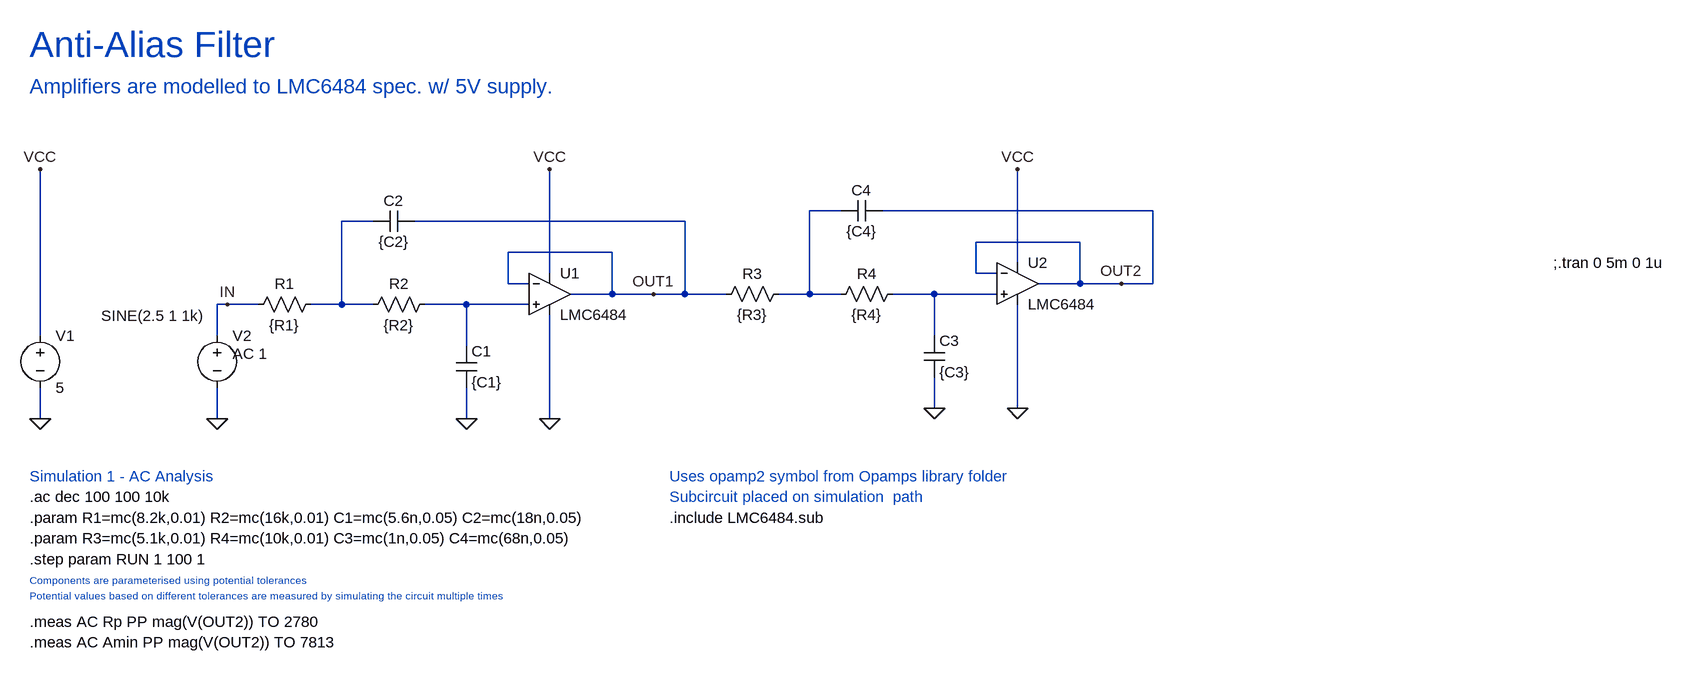
[diagram p0: schematic LMC6484_Lowpass_Toleranced(1).asc]
LMC6484_Lowpass_Toleranced(1).asc, the LTspice schematic file:
Version 4
SHEET 1 1812 800
WIRE 528 64 480 64
WIRE 1008 64 592 64
WIRE -192 80 -240 80
WIRE 288 80 -128 80
WIRE 896 112 736 112
WIRE 176 128 16 128
WIRE 800 144 800 0
WIRE 80 160 80 0
WIRE 736 160 736 112
WIRE 768 160 736 160
WIRE 16 176 16 128
WIRE 48 176 16 176
WIRE 896 176 896 112
WIRE 896 176 832 176
WIRE 960 176 896 176
WIRE 1008 176 1008 64
WIRE 1008 176 960 176
WIRE 176 192 176 128
WIRE 176 192 112 192
WIRE 240 192 176 192
WIRE 288 192 288 80
WIRE 288 192 240 192
WIRE 352 192 288 192
WIRE 480 192 480 64
WIRE 480 192 432 192
WIRE 528 192 480 192
WIRE 672 192 608 192
WIRE 768 192 672 192
WIRE -416 208 -432 208
WIRE -368 208 -416 208
WIRE -240 208 -240 80
WIRE -240 208 -288 208
WIRE -192 208 -240 208
WIRE -48 208 -112 208
WIRE 48 208 -48 208
WIRE -704 256 -704 0
WIRE -432 256 -432 208
WIRE 672 256 672 192
WIRE -48 272 -48 208
WIRE 672 368 672 320
WIRE 800 368 800 208
WIRE -704 384 -704 336
WIRE -432 384 -432 336
WIRE -48 384 -48 336
WIRE 80 384 80 224
FLAG 80 384 0
FLAG -432 384 0
FLAG -704 384 0
FLAG -48 384 0
FLAG 240 192 OUT1
FLAG 800 368 0
FLAG 672 368 0
FLAG 960 176 OUT2
FLAG -416 208 IN
FLAG 80 0 VCC
FLAG 800 0 VCC
FLAG -704 0 VCC
SYMBOL Opamps\\opamp2 80 128 R0
SYMATTR InstName U1
SYMATTR Value LMC6484
SYMBOL voltage -704 240 R0
SYMATTR InstName V1
SYMATTR Value 5
SYMBOL res -272 192 R90
WINDOW 0 0 56 VBottom 2
WINDOW 3 32 56 VTop 2
SYMATTR InstName R1
SYMATTR Value {R1}
SYMBOL voltage -432 240 R0
WINDOW 3 -178 -15 Left 2
WINDOW 123 24 44 Left 2
WINDOW 39 0 0 Left 2
SYMATTR Value SINE(2.5 1 1k)
SYMATTR Value2 AC 1
SYMATTR InstName V2
SYMBOL res -96 192 R90
WINDOW 0 0 56 VBottom 2
WINDOW 3 32 56 VTop 2
SYMATTR InstName R2
SYMATTR Value {R2}
SYMBOL cap -64 272 R0
SYMATTR InstName C1
SYMATTR Value {C1}
SYMBOL cap -128 64 R90
WINDOW 0 0 32 VBottom 2
WINDOW 3 32 32 VTop 2
SYMATTR InstName C2
SYMATTR Value {C2}
SYMBOL Opamps\\opamp2 800 112 R0
SYMATTR InstName U2
SYMATTR Value LMC6484
SYMBOL res 448 176 R90
WINDOW 0 0 56 VBottom 2
WINDOW 3 32 56 VTop 2
SYMATTR InstName R3
SYMATTR Value {R3}
SYMBOL res 624 176 R90
WINDOW 0 0 56 VBottom 2
WINDOW 3 32 56 VTop 2
SYMATTR InstName R4
SYMATTR Value {R4}
SYMBOL cap 656 256 R0
SYMATTR InstName C3
SYMATTR Value {C3}
SYMBOL cap 592 48 R90
WINDOW 0 0 32 VBottom 2
WINDOW 3 32 32 VTop 2
SYMATTR InstName C4
SYMATTR Value {C4}
TEXT 264 536 Left 2 !.include LMC6484.sub
TEXT 1624 144 Left 2 !;.tran 0 5m 0 1u
TEXT -720 504 Left 2 !.ac dec 100 100 10k
TEXT -720 600 Left 2 !.step param RUN 1 100 1
TEXT -720 696 Left 2 !.meas AC Rp PP mag(V(OUT2)) TO 2780
TEXT -720 728 Left 2 !.meas AC Amin PP mag(V(OUT2)) TO 7813
TEXT -720 568 Left 2 !.param R3=mc(5.1k,0.01) R4=mc(10k,0.01) C3=mc(1n,0.05) C4=mc(68n,0.05)
TEXT -720 536 Left 2 !.param R1=mc(8.2k,0.01) R2=mc(16k,0.01) C1=mc(5.6n,0.05) C2=mc(18n,0.05)
TEXT -720 -192 Left 5 ;Anti-Alias Filter
TEXT -720 -128 Left 3 ;Amplifiers are modelled to LMC6484 spec. w/ 5V supply.
TEXT 264 472 Left 2 ;Uses opamp2 symbol from Opamps library folder
TEXT 264 504 Left 2 ;Subcircuit placed on simulation  path
TEXT -720 472 Left 2 ;Simulation 1 - AC Analysis
TEXT -720 632 Left 1 ;Components are parameterised using potential tolerances
TEXT -720 656 Left 1 ;Potential values based on different tolerances are measured by simulating the circuit multiple times

The netlist it stands for:
* LMC6484_Lowpass_Toleranced(1).asc
XU1 N004 OUT1 VCC 0 OUT1 LMC6484  ; pins In+ In- V+ V- OUT
V1 VCC 0 5
R1 N002 IN {R1}
V2 IN 0 SINE(2.5 1 1k) AC 1
R2 N004 N002 {R2}
C1 N004 0 {C1}
C2 OUT1 N002 {C2}
XU2 N003 OUT2 VCC 0 OUT2 LMC6484  ; pins In+ In- V+ V- OUT
R3 N001 OUT1 {R3}
R4 N003 N001 {R4}
C3 N003 0 {C3}
C4 OUT2 N001 {C4}
.include LMC6484.sub
;.tran 0 5m 0 1u
.ac dec 100 100 10k
.step param RUN 1 100 1
.meas AC Rp PP mag(V(OUT2)) TO 2780
.meas AC Amin PP mag(V(OUT2)) TO 7813
.param R3=mc(5.1k,0.01) R4=mc(10k,0.01) C3=mc(1n,0.05) C4=mc(68n,0.05)
.param R1=mc(8.2k,0.01) R2=mc(16k,0.01) C1=mc(5.6n,0.05) C2=mc(18n,0.05)
* Anti-Alias Filter
* Amplifiers are modelled to LMC6484 spec. w/ 5V supply.
* Uses opamp2 symbol from Opamps library folder
* Subcircuit placed on simulation  path
* Simulation 1 - AC Analysis
* Components are parameterised using potential tolerances
* Potential values based on different tolerances are measured by simulating the circuit multiple times
.backanno
.end